# Altium schematic sheet PAGE2-POWER.SchDoc (part 1 of 2)
size A3; DocumentNumber: 2; SheetNumber: 2; SheetTotal: 2
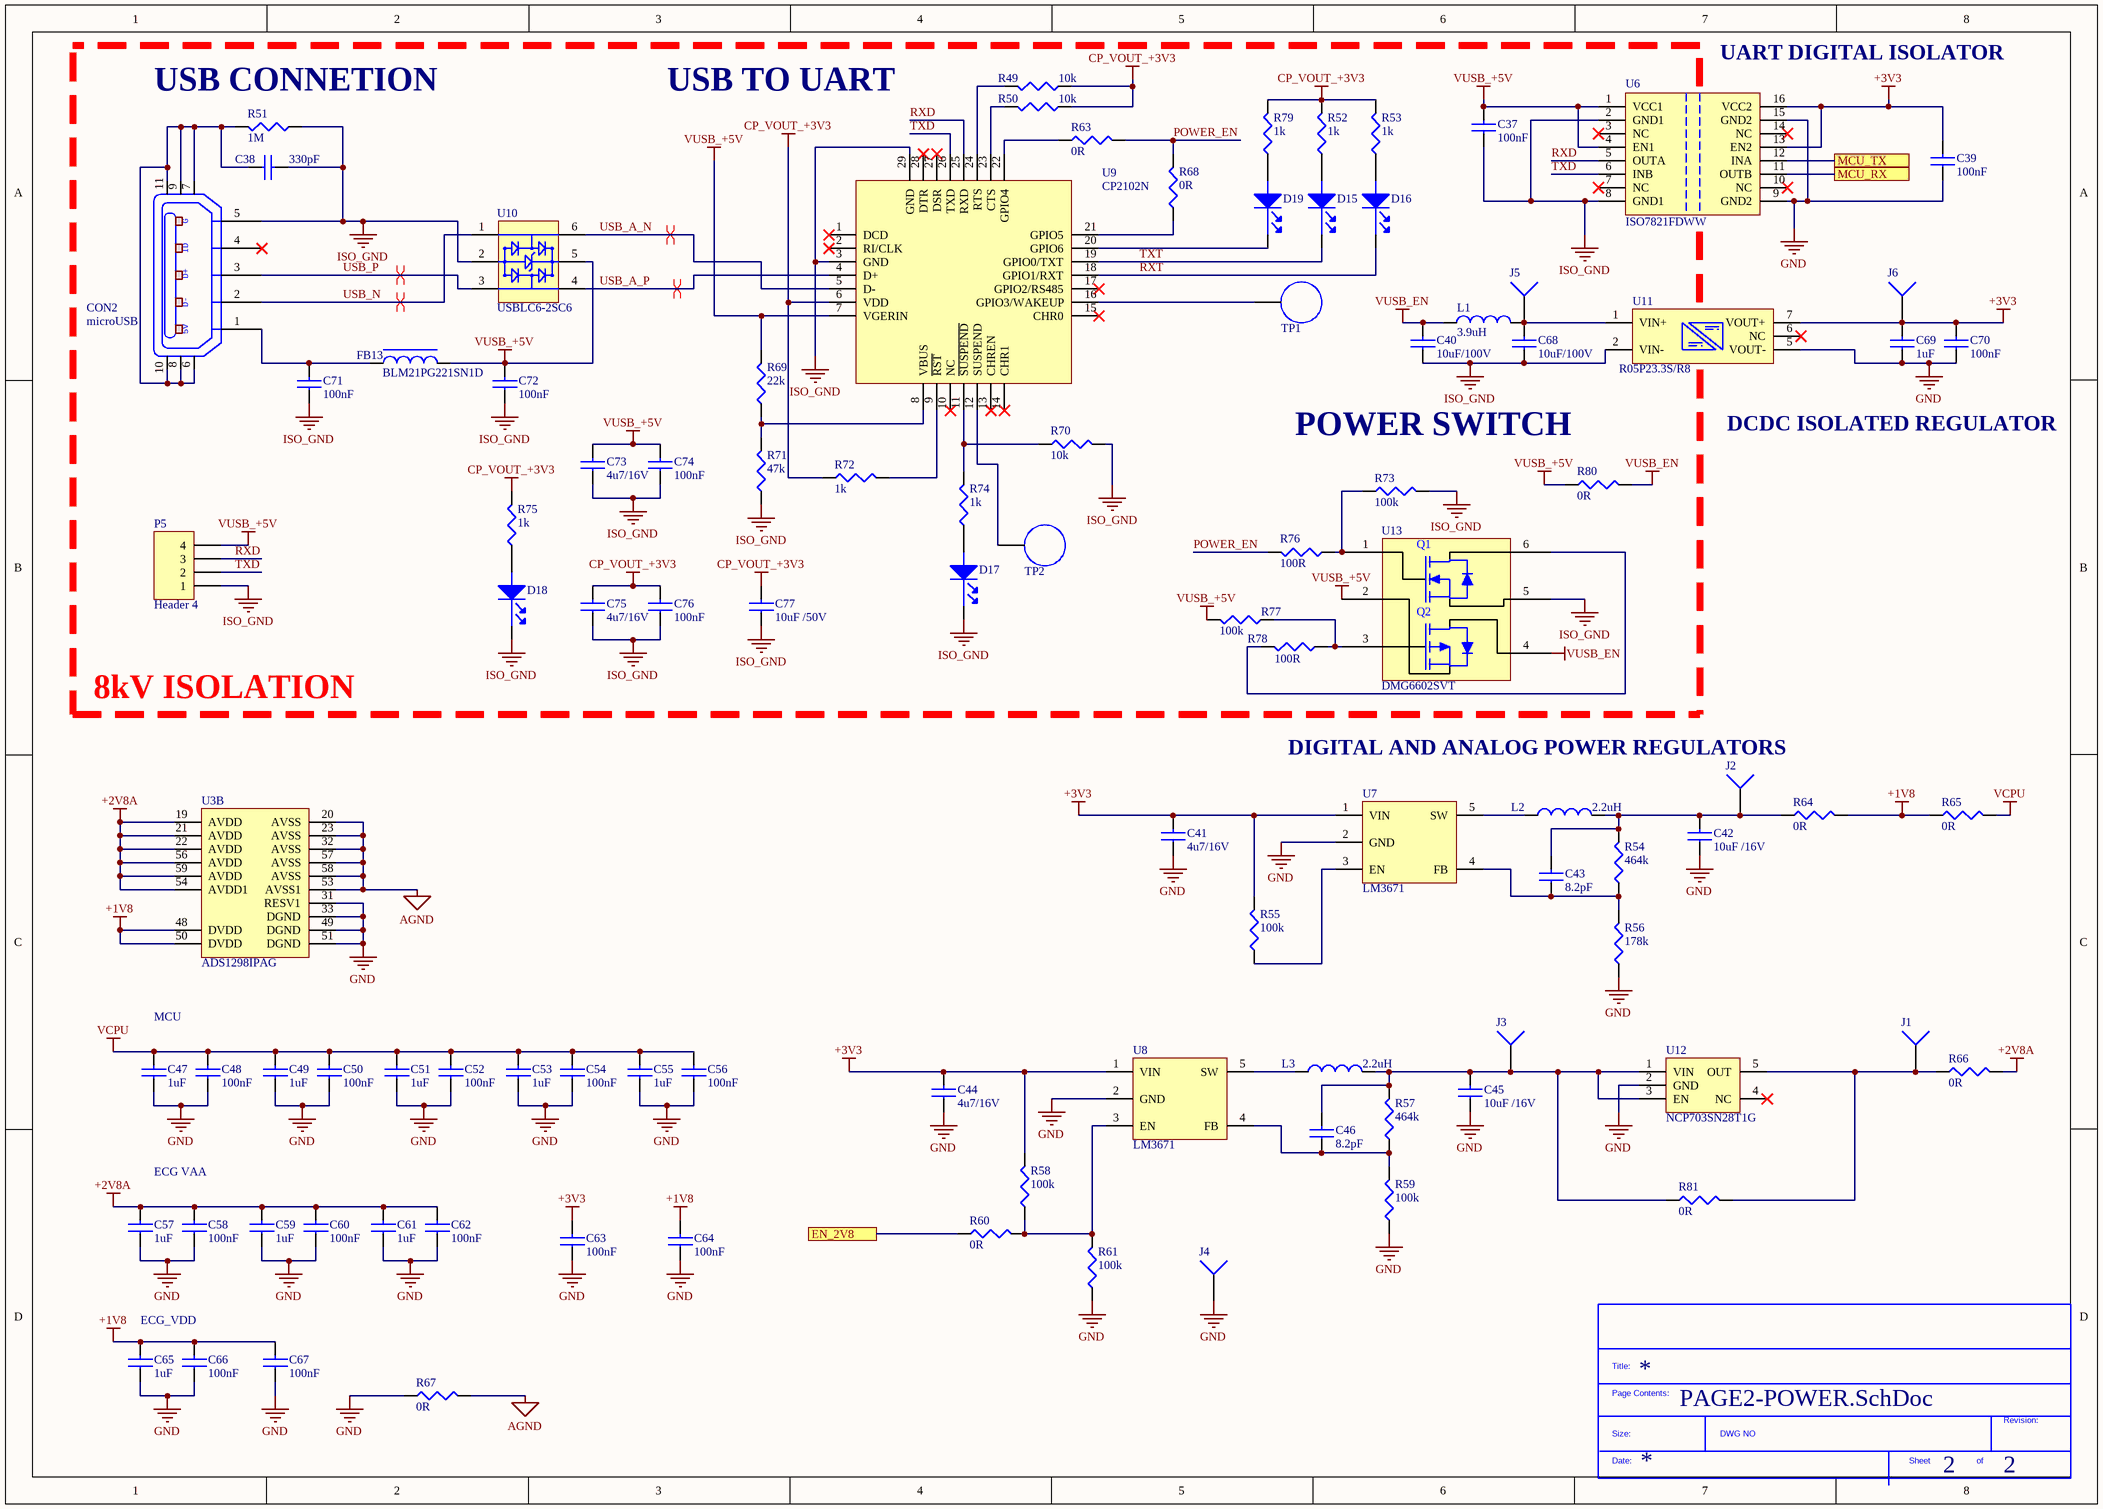
[diagram p0: PAGE2-POWER.SchDoc]

## Parts
*?  SDTitleBlock  (value not drawn)  (graphical)
C37  100nF  [CAP0603]
C38  330pF  [CAP0603]
C39  100nF  [CAP0603]
C40  10uF/100V  [CAP2220]
C41  4u7/16V  [CAP0603]
C42  10uF /16V  [CAP0805]
C43  8.2pF  [CAP0603]
C44  4u7/16V  [CAP0603]
C45  10uF /16V  [CAP0805]
C46  8.2pF  [CAP0603]
C47  1uF  [CAP0603]
C48  100nF  [CAP0603]
C49  1uF  [CAP0603]
C50  100nF  [CAP0603]
C51  1uF  [CAP0603]
C52  100nF  [CAP0603]
C53  1uF  [CAP0603]
C54  100nF  [CAP0603]
C55  1uF  [CAP0603]
C56  100nF  [CAP0603]
C57  1uF  [CAP0603]
C58  100nF  [CAP0603]
C59  1uF  [CAP0603]
C60  100nF  [CAP0603]
C61  1uF  [CAP0603]
C62  100nF  [CAP0603]
C63  100nF  [CAP0603]
C64  100nF  [CAP0603]
C65  1uF  [CAP0603]
C66  100nF  [CAP0603]
C67  100nF  [CAP0603]
C68  10uF/100V  [CAP2220]
C69  1uF  [CAP0603]
C70  100nF  [CAP0603]
C71  100nF  [CAP0603]
C72  100nF  [CAP0603]
C73  4u7/16V  [CAP0603]
C74  100nF  [CAP0603]
C75  4u7/16V  [CAP0603]
C76  100nF  [CAP0603]
C77  10uF /50V  [CAP1206]
CON2  microUSB  [microUSB-CHINA]  (no BOM)
D15  LED RED  [LED0603]  (value not drawn)
D16  LED RED  [LED0603]  (value not drawn)
D17  LED RED  [LED0603]  (value not drawn)
D18  LED RED  [LED0603]  (value not drawn)
D19  LED RED  [LED0603]  (value not drawn)
FB13  BLM21PG221SN1D  [IND0805]
J1  Socket  [PIN1]  (value not drawn)  (no BOM)
J2  Socket  [PIN1]  (value not drawn)  (no BOM)
J3  Socket  [PIN1]  (value not drawn)  (no BOM)
J4  Socket  [PIN1]  (value not drawn)  (no BOM)
J5  Socket  [PIN1]  (value not drawn)  (no BOM)
J6  Socket  [PIN1]  (value not drawn)  (no BOM)
L1  3.9uH  [IND54X36]
L2  2.2uH  [IND2.3X1.7]
L3  2.2uH  [IND2.3X1.7]
P5  Header 4  [HDR1X4]  (no BOM)
R49  10k  [RES0603]
R50  10k  [RES0603]
R51  1M  [RES0603]
R52  1k  [RES0603]
R53  1k  [RES0603]
R54  464k  [RES0603]
R55  100k  [RES0603]
R56  178k  [RES0603]
R57  464k  [RES0603]
R58  100k  [RES0603]
R59  100k  [RES0603]
R60  0R  [RES0603]
R61  100k  [RES0603]
R63  0R  [RES0603]
R64  0R  [RES0603]
R65  0R  [RES0603]
R66  0R  [RES0603]
R67  0R  [RES0603]
R68  0R  [RES0603]
R69  22k  [RES0603]
R70  10k  [RES0603]
R71  47k  [RES0603]
R72  1k  [RES0603]
R73  100k  [RES0603]
R74  1k  [RES0603]
R75  1k  [RES0603]
R76  100R  [RES0603]
R77  100k  [RES0603]
R78  100R  [RES0603]
R79  1k  [RES0603]
R80  0R  [RES0603]
R81  0R  [RES0603]
TP1  TEST POINT  [TEST_POINT]  (value not drawn)  (no BOM)
TP2  TEST POINT  [TEST_POINT]  (value not drawn)  (no BOM)
U3  ADS1298IPAG  [TSQFP50P1200X1200X120-64N]  (part B of 2)
U6  ISO7821FDWW  [SOIC127P1720X264-16N]
U7  LM3671  [SOT95P280X145-5N]
U8  LM3671  [SOT95P280X145-5N]
U9  CP2102N  [QFN50P500X500X80_HS-29N]
U10  USBLC6-2SC6  [SOT95P280X145-6N]
U11  R05P23.3S/R8  [DCDC]
U12  NCP703SN28T1G  [TSOP95P280X110-6N]
U13  DMG6602SVT  [TSOT26]

## Ports
EN_2V8, MCU_RX, MCU_TX

## Nets
+1V8: C64.2 C65.2 C66.2 C67.2 R64.2 R65.1 U3.48(DVDD) U3.50(DVDD)
+2V8A: C57.2 C58.2 C59.2 C60.2 C61.2 C62.2 R66.2 U3.19(AVDD) U3.21(AVDD) U3.22(AVDD) U3.54(AVDD1) U3.56(AVDD) U3.59(AVDD)
+3V3: C39.2 C41.2 C44.2 C63.2 C69.2 C70.2 J6.1 R55.2 R58.2 U6.13(EN2) U6.16(VCC2) U7.1(VIN) U8.1(VIN) U11.7(VOUT+)
AGND: R67.2 U3.20(AVSS) U3.23(AVSS) U3.32(AVSS) U3.53(AVSS1) U3.57(AVSS) U3.58(AVSS)
CP_VOUT_+3V3: C75.2 C76.2 C77.2 R49.1 R50.1 R52.2 R53.2 R72.1 R75.2 R79.2 U9.6(VDD)
GND: C39.1 C41.1 C42.1 C44.1 C45.1 C47.1 C48.1 C49.1 C50.1 C51.1 C52.1 C53.1 C54.1 C55.1 C56.1 C57.1 C58.1 C59.1 C60.1 C61.1 C62.1 C63.1 C64.1 C65.1 C66.1 C67.1 C69.1 C70.1 J4.1 R56.1 R59.1 R61.1 R67.1 U3.31(RESV1) U3.33(DGND) U3.49(DGND) U3.51(DGND) U6.9(GND2) U6.15(GND2) U7.2(GND) U8.2(GND) U11.5(VOUT-) U12.2(GND)
ISO_GND: C37.1 C38.2 C40.1 C68.1 C71.1 C72.1 C73.1 C74.1 C75.1 C76.1 C77.1 CON2.5(P5) D17.1(cathode) D18.1(cathode) P5.1 R51.1 R70.2 R71.1 R73.2 U6.2(GND1) U6.8(GND1) U9.3(GND) U9.29(GND) U10.2 U11.2(VIN-) U13.5(S1)
VCPU: C47.2 C48.2 C49.2 C50.2 C51.2 C52.2 C53.2 C54.2 C55.2 C56.2 R65.2
VUSB_+5V: C37.2 C72.2 C73.2 C74.2 FB13.2 P5.4 R69.2 R77.2 R80.1 U6.1(VCC1) U6.4(EN1) U9.7(VGERIN) U10.5 U13.2(S2)
VUSB_EN: C40.2 L1.1 R80.2 U13.4(D2)
EN_2V8: R60.1 ; port EN_2V8
MCU_RX: U6.11(OUTB) ; port MCU_RX
MCU_TX: U6.12(INA) ; port MCU_TX
POWER_EN: R63.2 R68.2 R76.2
RXD: P5.3 U6.5(OUTA) U9.25(RXD)
RXT: D16.1(cathode) U9.18(GPIO1/RXT)
TXD: P5.2 U6.6(INB) U9.26(TXD)
TXT: D15.1(cathode) U9.19(GPIO0/TXT)
USB_A_N: U9.5(D-) U10.6
USB_A_P: U9.4(D+) U10.4
USB_N: CON2.2(P2) U10.1
USB_P: CON2.3(P3) U10.3
NetC38_1: C38.1 CON2.6 CON2.7 CON2.8 CON2.9 CON2.10 CON2.11 R51.2
NetC42_2: C42.2 C43.2 J2.1 L2.2 R54.2 R64.1
NetC43_1: C43.1 R54.1 R56.2 U7.4(FB)
NetC45_2: C45.2 C46.2 J3.1 L3.2 R57.2 R81.1 U12.1(VIN) U12.3(EN)
NetC46_1: C46.1 R57.1 R59.2 U8.4(FB)
NetC68_2: C68.2 J5.1 L1.2 U11.1(VIN+)
NetC71_2: C71.2 CON2.1(P1) FB13.1
NetD15_2: D15.2(ANODE) R52.1
NetD16_2: D16.2(ANODE) R53.1
NetD17_2: D17.2(ANODE) R74.1
NetD18_2: D18.2(ANODE) R75.1
NetD19_1: D19.1(cathode) U9.20(GPIO6)
NetD19_2: D19.2(ANODE) R79.1
NetJ1_1: J1.1 R66.1 R81.2 U12.5(OUT)
NetL2_1: L2.1 U7.5(SW)
NetL3_1: L3.1 U8.5(SW)
NetR49_2: R49.2 U9.24(RTS)
NetR50_2: R50.2 U9.23(CTS)
NetR55_1: R55.1 U7.3(EN)
NetR58_1: R58.1 R60.2 R61.2 U8.3(EN)
NetR63_1: R63.1 U9.22(GPIO4)
NetR68_1: R68.1 U9.21(GPIO5)
NetR69_1: R69.1 R71.2 U9.8(VBUS)
NetR70_1: R70.1 R74.2 U9.11(~{SUSPEND})
NetR72_2: R72.2 U9.9(~{RST})
NetR73_1: R73.1 R76.1 U13.1(G1)
NetR77_1: R77.1 R78.1 U13.3(G2)
NetR78_2: R78.2 U13.6(D1)
NetTP1_1: TP1.1 U9.16(GPIO3/WAKEUP)
NetTP2_1: TP2.1 U9.12(SUSPEND)

Not connected (* = marked no-connect by the designer): CON2 4(P4)*; U6 3(NC)* 7(NC)* 10(NC)* 14(NC)*; U9 1(DCD)* 2(RI/CLK)* 10(NC)* 13(CHREN)* 14(CHR1)* 15(CHR0)* 17(GPIO2/RS485)* 27(DSR)* 28(DTR)*; U11 6(NC)*; U12 4(NC)*

## Layout directives
differential pair: USB_A_N, USB_A_P, USB_N, USB_P

## Notes on the sheet
- (near R51) USB CONNETION
- USB TO UART
- (near U6) UART DIGITAL ISOLATOR
- POWER SWITCH
- DCDC ISOLATED REGULATOR
- 8kV ISOLATION
- DIGITAL AND ANALOG POWER REGULATORS
- MCU
- ECG VAA
- ECG_VDD
- (in symbol DMG6602SVT) Q1; Q2
- (in symbol Micro USB CHINA 1) G; ID; D+; D-; 5V
- (in symbol SDTitleBlock) Title:; Page Contents:; Revision:; Size:; DWG NO; Date:; Sheet; of